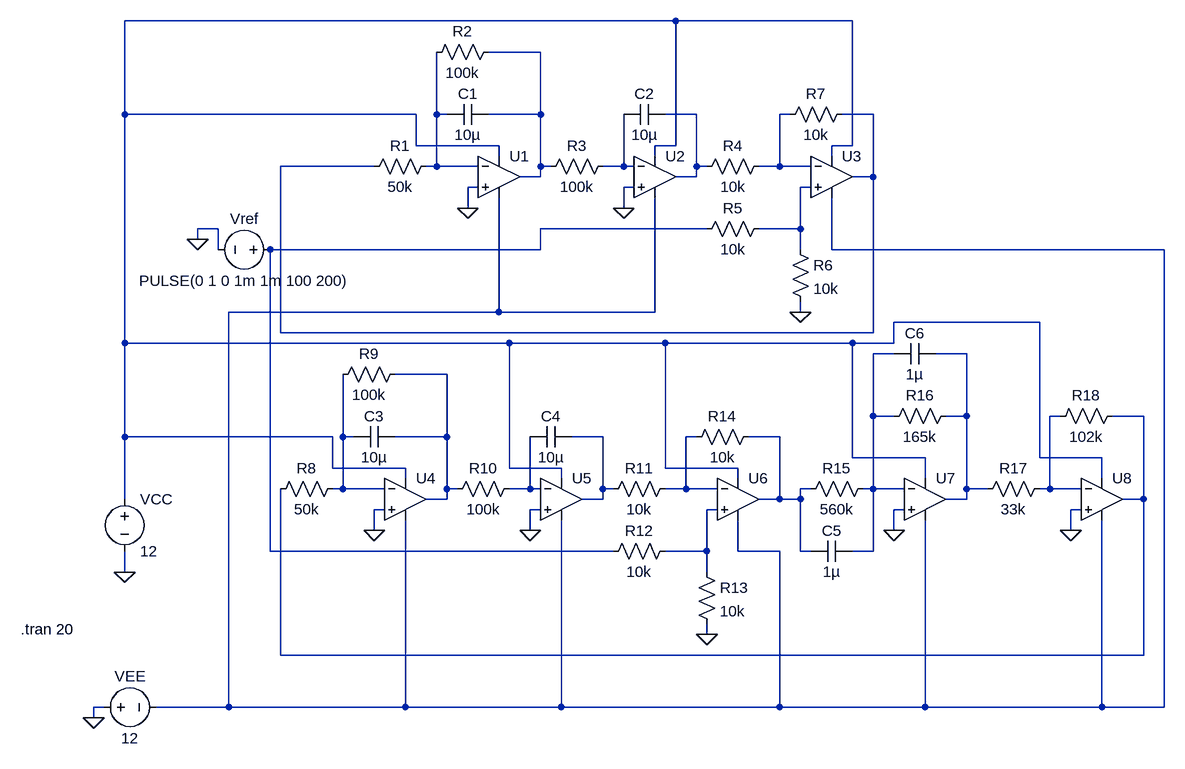
[diagram p0: schematic lead-compensator.asc]
lead-compensator.asc, the LTspice schematic file:
Version 4.1
SHEET 1 1592 848
WIRE 256 -272 -592 -272
WIRE 528 -272 256 -272
WIRE 48 -224 -32 -224
WIRE -592 -128 -592 -272
WIRE -144 -128 -592 -128
WIRE -112 -128 -112 -224
WIRE -96 -128 -112 -128
WIRE 48 -128 48 -224
WIRE 48 -128 -32 -128
WIRE 288 -128 240 -128
WIRE 432 -128 416 -128
WIRE 560 -128 512 -128
WIRE -144 -80 -144 -128
WIRE -16 -80 -144 -80
WIRE 256 -80 256 -272
WIRE 256 -80 224 -80
WIRE 528 -80 528 -272
WIRE 528 -80 496 -80
WIRE -16 -64 -16 -80
WIRE 224 -64 224 -80
WIRE 496 -64 496 -80
WIRE -208 -48 -352 -48
WIRE -112 -48 -112 -128
WIRE -112 -48 -128 -48
WIRE -48 -48 -112 -48
WIRE 48 -48 48 -128
WIRE 64 -48 48 -48
WIRE 176 -48 176 -128
WIRE 176 -48 144 -48
WIRE 192 -48 176 -48
WIRE 288 -48 288 -128
WIRE 304 -48 288 -48
WIRE 416 -48 416 -128
WIRE 416 -48 384 -48
WIRE 464 -48 416 -48
WIRE 48 -32 48 -48
WIRE 48 -32 16 -32
WIRE 288 -32 288 -48
WIRE 288 -32 256 -32
WIRE 560 -32 560 -128
WIRE 560 -32 528 -32
WIRE -48 -16 -64 -16
WIRE 192 -16 176 -16
WIRE 464 -16 448 -16
WIRE -64 16 -64 -16
WIRE 176 16 176 -16
WIRE -448 48 -480 48
WIRE 304 48 48 48
WIRE 448 48 448 -16
WIRE 448 48 384 48
WIRE -480 64 -480 48
WIRE -448 80 -448 48
WIRE 48 80 48 48
WIRE 48 80 -368 80
WIRE 448 80 448 48
WIRE 496 80 496 0
WIRE 1008 80 496 80
WIRE -16 176 -16 0
WIRE -16 176 -432 176
WIRE 224 176 224 0
WIRE 224 176 -16 176
WIRE 448 176 448 160
WIRE 816 192 592 192
WIRE -352 208 -352 -48
WIRE 560 208 560 -32
WIRE 560 208 -352 208
WIRE -592 224 -592 -128
WIRE 0 224 -592 224
WIRE 240 224 0 224
WIRE 528 224 240 224
WIRE 592 224 592 192
WIRE 592 224 528 224
WIRE 592 240 560 240
WIRE 704 240 656 240
WIRE -96 272 -176 272
WIRE 560 336 560 240
WIRE 592 336 560 336
WIRE 704 336 704 240
WIRE 704 336 672 336
WIRE 848 336 832 336
WIRE 976 336 928 336
WIRE -592 368 -592 224
WIRE -272 368 -592 368
WIRE -256 368 -256 272
WIRE -240 368 -256 368
WIRE -96 368 -96 272
WIRE -96 368 -176 368
WIRE 144 368 96 368
WIRE 288 368 272 368
WIRE 416 368 368 368
WIRE 528 400 528 224
WIRE 640 400 528 400
WIRE 816 400 816 192
WIRE 912 400 816 400
WIRE -272 416 -272 368
WIRE -160 416 -272 416
WIRE 0 416 0 224
WIRE 80 416 0 416
WIRE 240 416 240 224
WIRE 352 416 240 416
WIRE -160 432 -160 416
WIRE 80 432 80 416
WIRE 352 432 352 416
WIRE 640 432 640 400
WIRE 912 432 912 400
WIRE -256 448 -256 368
WIRE -256 448 -272 448
WIRE -192 448 -256 448
WIRE -96 448 -96 368
WIRE -80 448 -96 448
WIRE 32 448 32 368
WIRE 32 448 0 448
WIRE 48 448 32 448
WIRE 144 448 144 368
WIRE 160 448 144 448
WIRE 272 448 272 368
WIRE 272 448 240 448
WIRE 320 448 272 448
WIRE 464 448 448 448
WIRE 560 448 560 336
WIRE 560 448 544 448
WIRE 608 448 560 448
WIRE 704 448 704 336
WIRE 736 448 704 448
WIRE 832 448 832 336
WIRE 832 448 816 448
WIRE 880 448 832 448
WIRE -592 464 -592 368
WIRE -96 464 -96 448
WIRE -96 464 -128 464
WIRE 144 464 144 448
WIRE 144 464 112 464
WIRE 416 464 416 368
WIRE 416 464 384 464
WIRE 448 464 448 448
WIRE 448 464 416 464
WIRE 704 464 704 448
WIRE 704 464 672 464
WIRE 976 464 976 336
WIRE 976 464 944 464
WIRE -192 480 -208 480
WIRE 48 480 32 480
WIRE 320 480 304 480
WIRE 608 480 592 480
WIRE 880 480 864 480
WIRE -208 512 -208 480
WIRE 32 512 32 480
WIRE 592 512 592 480
WIRE 864 512 864 480
WIRE -368 544 -368 80
WIRE 160 544 -368 544
WIRE 304 544 304 480
WIRE 304 544 240 544
WIRE 352 544 352 496
WIRE 416 544 352 544
WIRE 448 544 448 464
WIRE 464 544 448 544
WIRE 560 544 560 448
WIRE 560 544 528 544
WIRE -592 576 -592 544
WIRE 304 576 304 544
WIRE 304 672 304 656
WIRE -352 704 -352 448
WIRE 976 704 976 464
WIRE 976 704 -352 704
WIRE -624 784 -640 784
WIRE -432 784 -432 176
WIRE -432 784 -544 784
WIRE -160 784 -160 496
WIRE -160 784 -432 784
WIRE 80 784 80 496
WIRE 80 784 -160 784
WIRE 416 784 416 544
WIRE 416 784 80 784
WIRE 640 784 640 496
WIRE 640 784 416 784
WIRE 912 784 912 496
WIRE 912 784 640 784
WIRE 1008 784 1008 80
WIRE 1008 784 912 784
WIRE -640 800 -640 784
FLAG -640 800 0
FLAG -64 16 0
FLAG 176 16 0
FLAG -480 64 0
FLAG 448 176 0
FLAG 592 512 0
FLAG 864 512 0
FLAG -208 512 0
FLAG 32 512 0
FLAG 304 672 0
FLAG -592 576 0
SYMBOL OpAmps\\UniversalOpAmp2 -16 -32 R0
SYMATTR InstName U1
SYMBOL OpAmps\\UniversalOpAmp2 224 -32 R0
SYMATTR InstName U2
SYMBOL OpAmps\\UniversalOpAmp2 496 -32 R0
SYMATTR InstName U3
SYMBOL voltage -592 448 R0
SYMATTR InstName VCC
SYMATTR Value 12
SYMBOL voltage -640 784 R270
WINDOW 0 32 56 VTop 2
WINDOW 3 -32 56 VBottom 2
SYMATTR InstName VEE
SYMATTR Value 12
SYMBOL OpAmps\\UniversalOpAmp2 640 464 R0
SYMATTR InstName U7
SYMBOL OpAmps\\UniversalOpAmp2 912 464 R0
SYMATTR InstName U8
SYMBOL cap -32 -144 R90
WINDOW 0 0 32 VBottom 2
WINDOW 3 32 32 VTop 2
SYMATTR InstName C1
SYMATTR Value 10µ
SYMBOL res -16 -240 R90
WINDOW 0 0 56 VBottom 2
WINDOW 3 32 56 VTop 2
SYMATTR InstName R2
SYMATTR Value 100k
SYMBOL res -112 -64 R90
WINDOW 0 0 56 VBottom 2
WINDOW 3 32 56 VTop 2
SYMATTR InstName R1
SYMATTR Value 50k
SYMBOL res 160 -64 R90
WINDOW 0 0 56 VBottom 2
WINDOW 3 32 56 VTop 2
SYMATTR InstName R3
SYMATTR Value 100k
SYMBOL cap 240 -144 R90
WINDOW 0 0 32 VBottom 2
WINDOW 3 32 32 VTop 2
SYMATTR InstName C2
SYMATTR Value 10µ
SYMBOL res 400 32 R90
WINDOW 0 0 56 VBottom 2
WINDOW 3 32 56 VTop 2
SYMATTR InstName R5
SYMATTR Value 10k
SYMBOL res 432 64 R0
SYMATTR InstName R6
SYMATTR Value 10k
SYMBOL res 528 -144 R90
WINDOW 0 0 56 VBottom 2
WINDOW 3 32 56 VTop 2
SYMATTR InstName R7
SYMATTR Value 10k
SYMBOL res 400 -64 R90
WINDOW 0 0 56 VBottom 2
WINDOW 3 32 56 VTop 2
SYMATTR InstName R4
SYMATTR Value 10k
SYMBOL voltage -352 80 R90
WINDOW 0 -32 56 VBottom 2
WINDOW 3 32 56 VTop 2
WINDOW 123 0 0 Left 0
WINDOW 39 0 0 Left 0
SYMATTR InstName Vref
SYMATTR Value PULSE(0 1 0 1m 1m 100 200)
SYMBOL res 560 432 R90
WINDOW 0 0 56 VBottom 2
WINDOW 3 32 56 VTop 2
SYMATTR InstName R15
SYMATTR Value 560k
SYMBOL cap 528 528 R90
WINDOW 0 0 32 VBottom 2
WINDOW 3 32 32 VTop 2
SYMATTR InstName C5
SYMATTR Value 1µ
SYMBOL res 688 320 R90
WINDOW 0 0 56 VBottom 2
WINDOW 3 32 56 VTop 2
SYMATTR InstName R16
SYMATTR Value 165k
SYMBOL cap 656 224 R90
WINDOW 0 0 32 VBottom 2
WINDOW 3 32 32 VTop 2
SYMATTR InstName C6
SYMATTR Value 1µ
SYMBOL res 832 432 R90
WINDOW 0 0 56 VBottom 2
WINDOW 3 32 56 VTop 2
SYMATTR InstName R17
SYMATTR Value 33k
SYMBOL res 944 320 R90
WINDOW 0 0 56 VBottom 2
WINDOW 3 32 56 VTop 2
SYMATTR InstName R18
SYMATTR Value 102k
SYMBOL OpAmps\\UniversalOpAmp2 -160 464 R0
SYMATTR InstName U4
SYMBOL OpAmps\\UniversalOpAmp2 80 464 R0
SYMATTR InstName U5
SYMBOL OpAmps\\UniversalOpAmp2 352 464 R0
SYMATTR InstName U6
SYMBOL cap -176 352 R90
WINDOW 0 0 32 VBottom 2
WINDOW 3 32 32 VTop 2
SYMATTR InstName C3
SYMATTR Value 10µ
SYMBOL res -160 256 R90
WINDOW 0 0 56 VBottom 2
WINDOW 3 32 56 VTop 2
SYMATTR InstName R9
SYMATTR Value 100k
SYMBOL res -256 432 R90
WINDOW 0 0 56 VBottom 2
WINDOW 3 32 56 VTop 2
SYMATTR InstName R8
SYMATTR Value 50k
SYMBOL res 16 432 R90
WINDOW 0 0 56 VBottom 2
WINDOW 3 32 56 VTop 2
SYMATTR InstName R10
SYMATTR Value 100k
SYMBOL cap 96 352 R90
WINDOW 0 0 32 VBottom 2
WINDOW 3 32 32 VTop 2
SYMATTR InstName C4
SYMATTR Value 10µ
SYMBOL res 256 528 R90
WINDOW 0 0 56 VBottom 2
WINDOW 3 32 56 VTop 2
SYMATTR InstName R12
SYMATTR Value 10k
SYMBOL res 288 560 R0
SYMATTR InstName R13
SYMATTR Value 10k
SYMBOL res 384 352 R90
WINDOW 0 0 56 VBottom 2
WINDOW 3 32 56 VTop 2
SYMATTR InstName R14
SYMATTR Value 10k
SYMBOL res 256 432 R90
WINDOW 0 0 56 VBottom 2
WINDOW 3 32 56 VTop 2
SYMATTR InstName R11
SYMATTR Value 10k
TEXT -752 664 Left 2 !.tran 20

The netlist it stands for:
* lead-compensator.asc
X§U1 0 N003 N001 N010 N002 level2 Avol=1Meg GBW=10Meg Slew=10Meg Ilimit=25m Rail=0 Vos=0 En=0 Enk=0 In=0 Ink=0 Rin=500Meg  ; pins In+ In- V+ V- OUT
X§U2 0 N007 N001 N010 N004 level2 Avol=1Meg GBW=10Meg Slew=10Meg Ilimit=25m Rail=0 Vos=0 En=0 Enk=0 In=0 Ink=0 Rin=500Meg  ; pins In+ In- V+ V- OUT
X§U3 N008 N005 N001 N010 N006 level2 Avol=1Meg GBW=10Meg Slew=10Meg Ilimit=25m Rail=0 Vos=0 En=0 Enk=0 In=0 Ink=0 Rin=500Meg  ; pins In+ In- V+ V- OUT
VCC N001 0 12
VEE 0 N010 12
X§U7 0 N011 N001 N010 N012 level2 Avol=1Meg GBW=10Meg Slew=10Meg Ilimit=25m Rail=0 Vos=0 En=0 Enk=0 In=0 Ink=0 Rin=500Meg  ; pins In+ In- V+ V- OUT
X§U8 0 N014 N001 N010 N015 level2 Avol=1Meg GBW=10Meg Slew=10Meg Ilimit=25m Rail=0 Vos=0 En=0 Enk=0 In=0 Ink=0 Rin=500Meg  ; pins In+ In- V+ V- OUT
C1 N002 N003 10µ
R2 N002 N003 100k
R1 N003 N006 50k
R3 N007 N002 100k
C2 N004 N007 10µ
R5 N008 N009 10k
R6 N008 0 10k
R7 N006 N005 10k
R4 N005 N004 10k
Vref N009 0 PULSE(0 1 0 1m 1m 100 200)
R15 N011 N019 560k
C5 N011 N019 1µ
R16 N012 N011 165k
C6 N012 N011 1µ
R17 N014 N012 33k
R18 N015 N014 102k
X§U4 0 N016 N001 N010 N013 level2 Avol=1Meg GBW=10Meg Slew=10Meg Ilimit=25m Rail=0 Vos=0 En=0 Enk=0 In=0 Ink=0 Rin=500Meg  ; pins In+ In- V+ V- OUT
X§U5 0 N020 N001 N010 N017 level2 Avol=1Meg GBW=10Meg Slew=10Meg Ilimit=25m Rail=0 Vos=0 En=0 Enk=0 In=0 Ink=0 Rin=500Meg  ; pins In+ In- V+ V- OUT
X§U6 N021 N018 N001 N010 N019 level2 Avol=1Meg GBW=10Meg Slew=10Meg Ilimit=25m Rail=0 Vos=0 En=0 Enk=0 In=0 Ink=0 Rin=500Meg  ; pins In+ In- V+ V- OUT
C3 N013 N016 10µ
R9 N013 N016 100k
R8 N016 N015 50k
R10 N020 N013 100k
C4 N017 N020 10µ
R12 N021 N009 10k
R13 N021 0 10k
R14 N019 N018 10k
R11 N018 N017 10k
.tran 20
.lib UniversalOpAmp2.lib
.backanno
.end